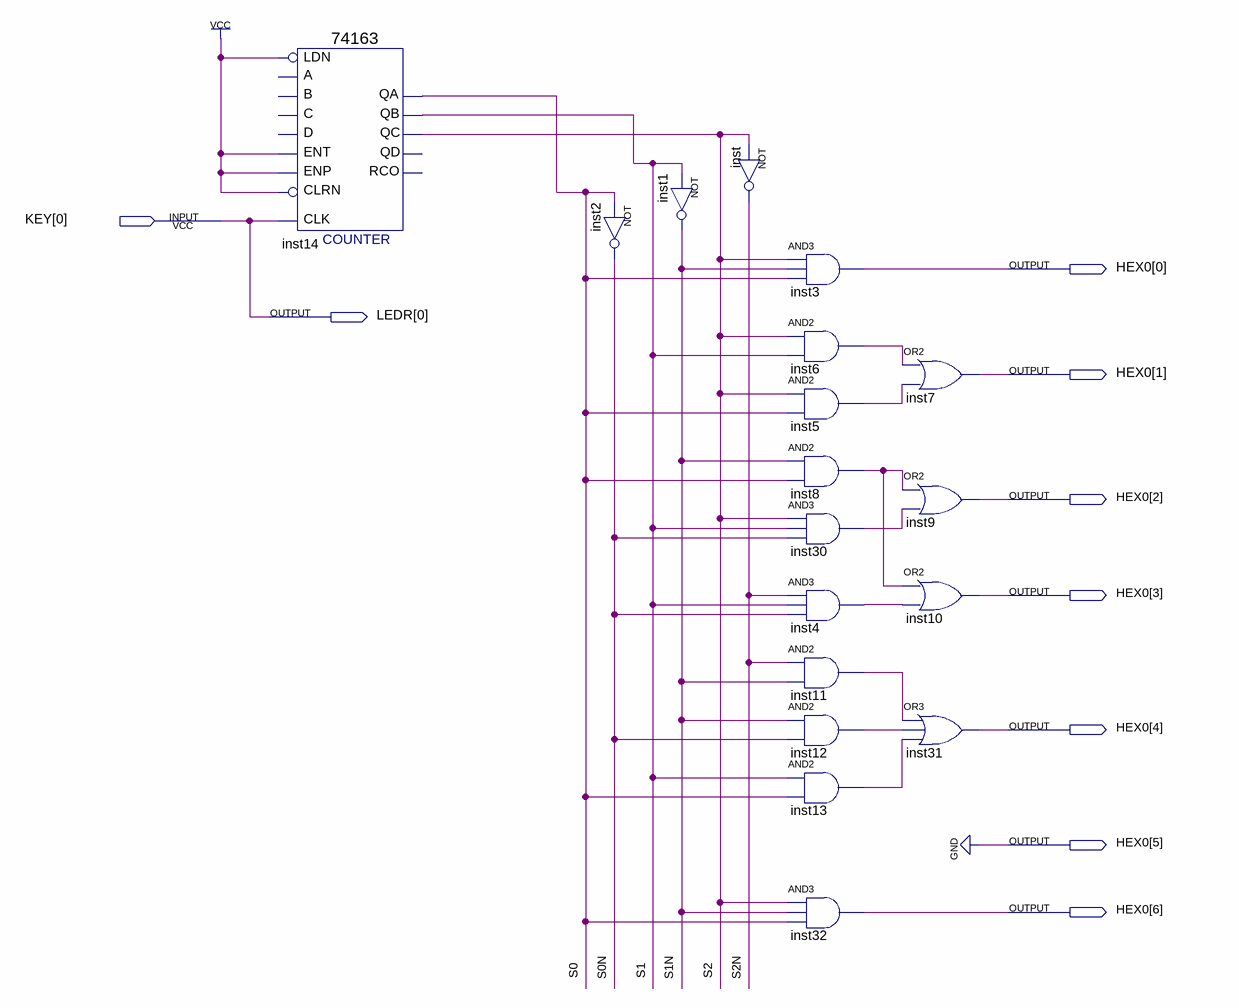
[diagram p0: schematic sheet]
// Quartus schematic sop_clk.bdf as structural Verilog: 18 symbols, 9 pins
module sop_clk (
  input  [0:0] KEY,
  output [6:0] HEX0,
  output [0:0] LEDR
);

  wire inst4_out, inst5_out, inst6_out, inst8_out, inst11_out, inst12_out, inst13_out, inst30_out, S0, S0N,
       S1, S1N, S2, S2N;

  \74163  inst14 (
    .ENT(1'b1), .CLRN(1'b1), .CLK(KEY[0]), .ENP(1'b1), .LDN(1'b1), .QA(S0), .QB(S1), .QC(S2));  // open: C, B, A, D, QD, RCO
  not inst1 (S1N, S1);
  not inst2 (S0N, S0);
  not inst (S2N, S2);
  and inst3 (HEX0[0], S2, S1N, S0);
  and inst6 (inst6_out, S2, S1);
  and inst5 (inst5_out, S2, S0);
  and inst8 (inst8_out, S1N, S0);
  and inst30 (inst30_out, S2, S1, S0N);
  and inst4 (inst4_out, S2N, S1, S0N);
  and inst11 (inst11_out, S2N, S1N);
  and inst12 (inst12_out, S1N, S0N);
  and inst13 (inst13_out, S1, S0);
  and inst32 (HEX0[6], S2, S1N, S0);
  or inst7 (HEX0[1], inst6_out, inst5_out);
  or inst9 (HEX0[2], inst8_out, inst30_out);
  or inst10 (HEX0[3], inst8_out, inst4_out);
  or inst31 (HEX0[4], inst11_out, inst12_out, inst13_out);

  assign HEX0[5] = 1'b0;
  assign LEDR[0] = KEY[0];
endmodule
